# EAGLE schematic ultrasonic-breakout-smd (EAGLE 7.1.0)
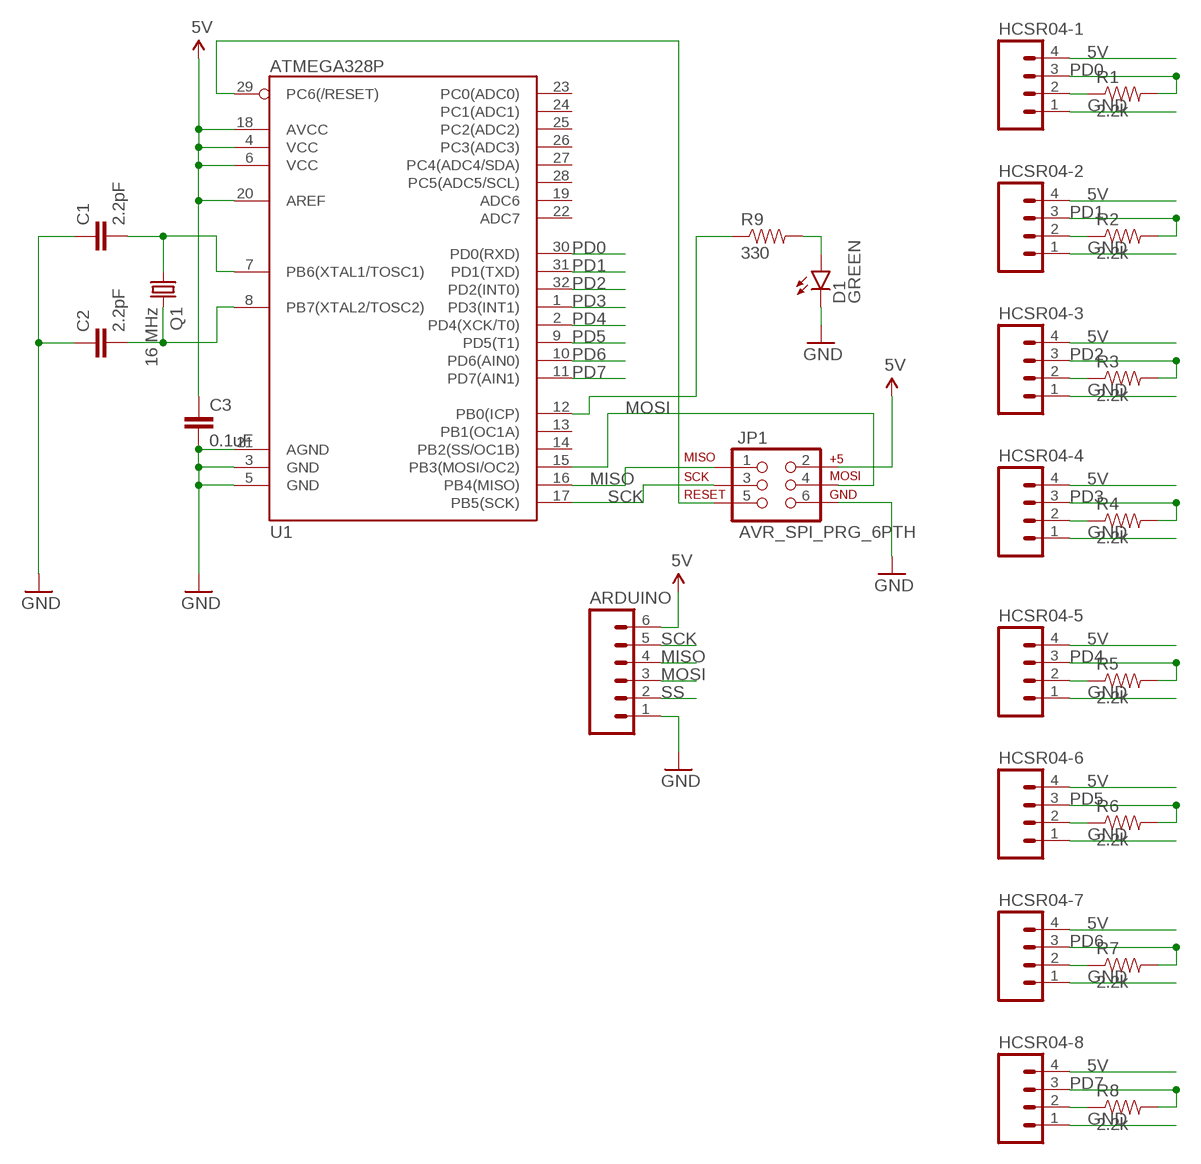
[diagram p0: schematic, sheet 1]

## Parts
ARDUINO  M06LOCK  [1X06_LOCK]
C1  2.2pF  CAP0402-CAP  [0402-CAP]
C2  2.2pF  CAP0402-CAP  [0402-CAP]
C3  0.1uF  CAP0402-CAP  [0402-CAP]
D1  GREEN  LED-GREEN0603  [LED-0603]
HCSR04-1  M04PTH  [1X04]
HCSR04-2  M04PTH  [1X04]
HCSR04-3  M04PTH  [1X04]
HCSR04-4  M04PTH  [1X04]
HCSR04-5  M04PTH  [1X04]
HCSR04-6  M04PTH  [1X04]
HCSR04-7  M04PTH  [1X04]
HCSR04-8  M04PTH  [1X04]
JP1  AVR_SPI_PRG_6PTH  [2X3]
Q1  16 MHz  CRYSTALHC49U-V  [HC49U-V]
R1  2.2k  RESISTOR0402-RES  [0402-RES]
R2  2.2k  RESISTOR0402-RES  [0402-RES]
R3  2.2k  RESISTOR0402-RES  [0402-RES]
R4  2.2k  RESISTOR0402-RES  [0402-RES]
R5  2.2k  RESISTOR0402-RES  [0402-RES]
R6  2.2k  RESISTOR0402-RES  [0402-RES]
R7  2.2k  RESISTOR0402-RES  [0402-RES]
R8  2.2k  RESISTOR0402-RES  [0402-RES]
R9  330  RESISTOR0402-RES  [0402-RES]
U1  ATMEGA328P  ATMEGA328_SMT  [TQFP32-08]

## Nets
5V: ARDUINO.6 C3.1 HCSR04-1.4 HCSR04-2.4 HCSR04-3.4 HCSR04-4.4 HCSR04-5.4 HCSR04-6.4 HCSR04-7.4 HCSR04-8.4 JP1.2 U1.4(VCC) U1.6(VCC) U1.18(AVCC) U1.20(AREF)
GND: ARDUINO.1 C1.1 C2.1 C3.2 D1.C HCSR04-1.1 HCSR04-2.1 HCSR04-3.1 HCSR04-4.1 HCSR04-5.1 HCSR04-6.1 HCSR04-7.1 HCSR04-8.1 JP1.6 U1.3(GND) U1.5(GND) U1.21(AGND)
MISO: ARDUINO.4 JP1.1 U1.16(PB4(MISO))
MOSI: ARDUINO.3 JP1.4 U1.15(PB3(MOSI/OC2))
N$1: C1.2 Q1.1 U1.7(PB6(XTAL1/TOSC1))
N$2: JP1.5 U1.29(PC6(/RESET))
N$3: C2.2 Q1.2 U1.8(PB7(XTAL2/TOSC2))
N$4: HCSR04-1.2 R1.1
N$5: HCSR04-2.2 R2.1
N$6: HCSR04-3.2 R3.1
N$7: HCSR04-4.2 R4.1
N$8: HCSR04-5.2 R5.1
N$9: HCSR04-6.2 R6.1
N$10: HCSR04-7.2 R7.1
N$11: HCSR04-8.2 R8.1
N$12: R9.1 U1.12(PB0(ICP))
N$13: D1.A R9.2
PD0: HCSR04-1.3 R1.2 U1.30(PD0(RXD))
PD1: HCSR04-2.3 R2.2 U1.31(PD1(TXD))
PD2: HCSR04-3.3 R3.2 U1.32(PD2(INT0))
PD3: HCSR04-4.3 R4.2 U1.1(PD3(INT1))
PD4: HCSR04-5.3 R5.2 U1.2(PD4(XCK/T0))
PD5: HCSR04-6.3 R6.2 U1.9(PD5(T1))
PD6: HCSR04-7.3 R7.2 U1.10(PD6(AIN0))
PD7: HCSR04-8.3 R8.2 U1.11(PD7(AIN1))
SCK: ARDUINO.5 JP1.3 U1.17(PB5(SCK))
SS: ARDUINO.2
Unconnected: U1.13(PB1(OC1A)) U1.14(PB2(SS/OC1B)) U1.19(ADC6) U1.22(ADC7) U1.23(PC0(ADC0)) U1.24(PC1(ADC1)) U1.25(PC2(ADC2)) U1.26(PC3(ADC3)) U1.27(PC4(ADC4/SDA)) U1.28(PC5(ADC5/SCL))

## Library data of the parts
ARDUINO = SparkFun-Connectors:M06: Header 6 Standard 6-pin 0.1" header. Use with straight break away headers (SKU : PRT-00116), right angle break away headers (PRT-00553), swiss pins (PRT-00743), machine pins (PRT-00117), and female headers (PRT-00115). Molex polarized connector foot print use with SKU : PRT-08094 with associated crimp pins and housings. NOTES ON THE VARIANTS LOCK and LOCK_LONGPADS... This footprint was designed to help hold the alignment of a through-hole component (i.e. 6-pin header) while soldering it into place. You may notice that each hole has been shifted either up or down by 0.005 of an inch from it's more standard position (which is a perfectly straight line). This slight alteration caused the pins (the squares in the middle) to touch the edges of the holes. Because they are alternating, it causes a "brace" to hold the component in place. 0.005 has proven to be the perfect amount of "off-center" position when using our standard breakaway headers. Although looks a little odd when you look at the bare footprint, once you have a header in there, the alteration is very hard to notice. Also,if you push a header all the way into place, it is covered up entirely on the bottom side. This idea of altering the position of holes to aid alignment will be further integrated into the Sparkfun Library for other footprints. It can help hold any component with 3 or more connection pins.
C1-C3 = SparkFun-Passives:CAP: Capacitor Standard 0603 ceramic capacitor, and 0.1" leaded capacitor.
D1 = SparkFun-LED:LED-GREEN: Various green LEDs Green LEDs used in SFE Production 0603- DIO-00821 LARGE- DIO-00862 LILYPAD- DIO-09910; PROD_ID: DIO-00821
HCSR04-1-HCSR04-8 = SparkFun-Connectors:M04: Header 4 Standard 4-pin 0.1" header. Use with straight break away headers (SKU : PRT-00116), right angle break away headers (PRT-00553), swiss pins (PRT-00743), machine pins (PRT-00117), and female headers (PRT-00115). Molex polarized connector foot print use with SKU : PRT-08231 with associated crimp pins and housings. 1MM SMD Version SKU: PRT-10208
JP1 = SparkFun-Connectors:AVR_SPI_PRG_6: AVR ISP 6 Pin This is the reduced ISP connector for AVR programming. Common on Arduino. This footprint will take up less PCB space and can be used with a 10-pin to 6-pin adapter such as SKU: BOB-08508 **Special note about "TEST_POINT" package. The stop mask is on the top side, so if you want your programming test points to be on the bottom of your board, make sure to place this package on the bottom side of the board. This also ensure that the orientation to program from the bottom side will be correct.
Q1 = crystal:CRYSTAL: CRYSTAL; OC_FARNELL: 1666969; OC_NEWARK: unknown
R1-R9 = SparkFun-Passives:RESISTOR: Resistor Basic schematic elements and footprints for 0603, 1206, and PTH resistors.
U1 = SparkFun-DigitalIC:ATMEGA328_SMT: 32-Pin Atmega328 part Commonly used on Arduino compatible boards Available in QFP and QFN packages TQFP is IC-09069 QFN is non-stock; PROD_ID: IC-09069